# EasyEDA Pro project Source.epro

# Schematic Schematic1
Board Name: Board1; Create Date: 2026-05-11; Page Name: P1; Project Name: my devboard; Schematic Name: Schematic1; Update Date: 2026-05-15; Company: EasyEDA.com; Page Size: A4; Version: V1.0
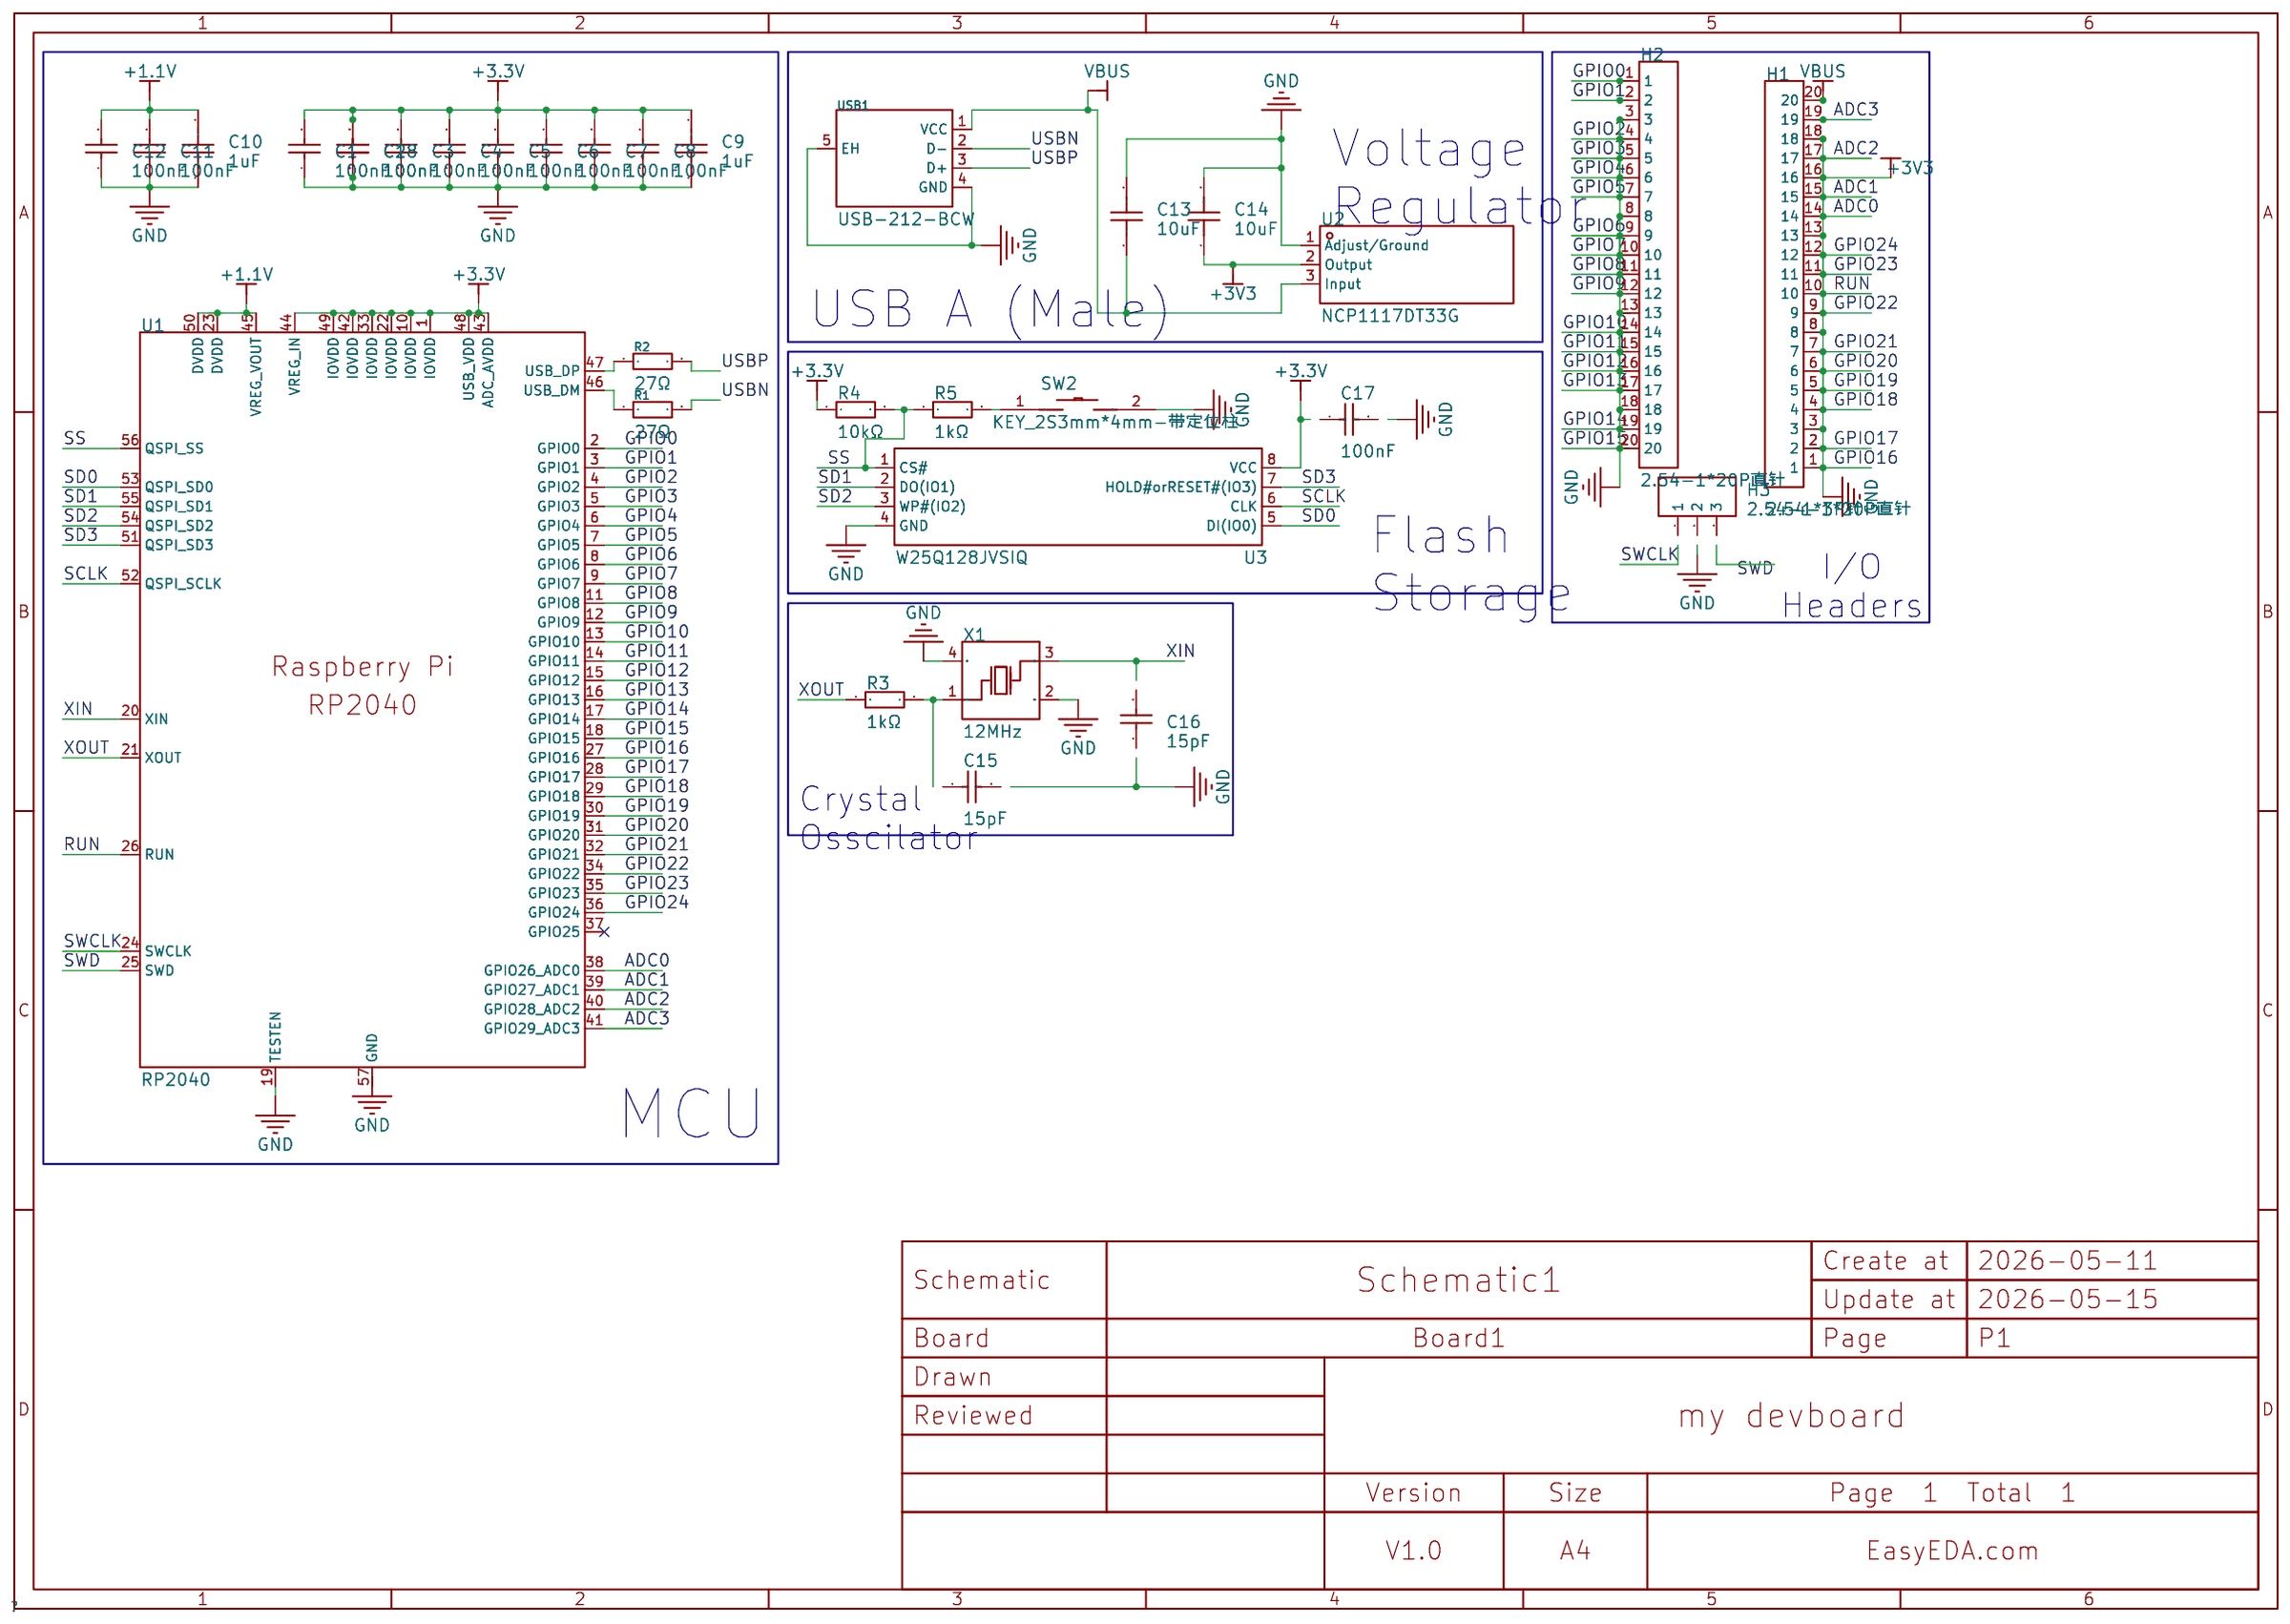
[diagram p0: schematic sheet]

## Parts
C1  100nF  [C0603]
C2  100nF  [C0603]
C3  100nF  [C0603]
C4  100nF  [C0603]
C5  100nF  [C0603]
C6  100nF  [C0603]
C7  100nF  [C0603]
C8  100nF  [C0603]
C9  1uF  [C0603]
C10  1uF  [C0603]
C11  100nF  [C0603]
C12  100nF  [C0603]
C13  10uF  [C0603]
C14  10uF  [C0603]
C15  15pF  [C0603]
C16  15pF  [C0603]
C17  100nF  [C0603]
C18  100nF  [C0603]
H1  2.54-1*20P直针  [HDR-TH_20P-P2.54-V-M-1]
H2  2.54-1*20P直针  [HDR-TH_20P-P2.54-V-M-1]
H3  2.54-1*3P针  [HDR-TH_3P-P2.54-V-M-1]
R1  27Ω  [R0603]
R2  27Ω  [R0603]
R3  1kΩ  [R0603]
R4  10kΩ  [R0603]
R5  1kΩ  [R0603]
SW2  KEY_2S3mm*4mm-带定位柱  [KEY-SMD_L4.0-W3.7-LS4.8]
U1  RP2040  [QFN-56_L7.0-W7.0-P0.40-TL-EP4.0]
U2  NCP1117DT33G  [TO-252_L6.5-W6.1-P4.58-LS9.9-BR]
U3  W25Q128JVSIQ  [SOIC-8_L5.3-W5.3-P1.27-LS8.0-BL]
USB1  USB-212-BCW  [USB-A-SMD_USB-212-BCW]
X1  12MHz  [CRYSTAL-SMD_4P-L3.2-W2.5-BL]

## Library data of the parts
C1-C8 C11 C12 C17 C18 = CT41G-0603-2X1-50V-0.1uF-K(N): Capacitance:100nF Tolerance:±10% Tolerance:±10% Voltage Rating:50V Temperature Coefficient:-; LCSC Part Name: 100nF ±10% 50V; Supplier Part: C125205; Manufacturer: TORCH(火炬); Supplier Footprint: 0603; JLCPCB Part Class: Extended Part; Datasheet: https://item.szlcsc.com/datasheet/CT41G-0603-2X1-50V-0.1uF-K(N)/136481.html; Supplier: LCSC; Tolerance: ±10%; Voltage Rating: 50V
C9 C10 = CL10A105KB8NNNC: Capacitance:1uF Tolerance:±10% Tolerance:±10% Voltage Rating:50V Temperature Coefficient:X5R; LCSC Part Name: 1uF ±10% 50V; Supplier Part: C15849; Manufacturer: SAMSUNG(三星); Supplier Footprint: 0603; JLCPCB Part Class: Basic Part; Datasheet: https://item.szlcsc.com/datasheet/CL10A105KB8NNNC/16531.html; Supplier: LCSC; Tolerance: ±10%; Voltage Rating: 50V; Temperature Coefficient: X5R
C13 C14 = CL10A106MA8NRNC: Capacitance:10uF Tolerance:±20% Tolerance:±20% Voltage Rating:25V Temperature Coefficient:X5R; LCSC Part Name: 10uF ±20% 25V; Supplier Part: C96446; Manufacturer: SAMSUNG(三星); Supplier Footprint: 0603; JLCPCB Part Class: Basic Part; Datasheet: https://item.szlcsc.com/datasheet/CL10A106MA8NRNC/97651.html; Supplier: LCSC; Tolerance: ±20%; Voltage Rating: 25V; Temperature Coefficient: X5R
C15 C16 = CL10C150JB8NNNC: Capacitance:15pF Tolerance:±5% Tolerance:±5% Voltage Rating:50V Temperature Coefficient:C0G; LCSC Part Name: 15pF ±5% 50V; Supplier Part: C1644; Manufacturer: SAMSUNG(三星); Supplier Footprint: 0603; JLCPCB Part Class: Basic Part; Datasheet: https://item.szlcsc.com/datasheet/CL10C150JB8NNNC/1996.html; Supplier: LCSC; Tolerance: ±5%; Voltage Rating: 50V; Temperature Coefficient: C0G
H1 H2 = 2.54-1*20P直针: Pin Structure:1x20P Pitch:2.54mm Row Spacing:- Circluar Pins/Square Pins:Pin Header Mounting Type:Through Hole Number of Rows:1 Number of Pins:20P Current Rating:3A Voltage Rating (Max):- Length of Mating Pin:- Insulation Height:- Length of End Connection; LCSC Part Name: 1x20P 间距:2.54mm 方针 直插; Supplier Part: C50981; Manufacturer: BOOMELE(博穆精密); Supplier Footprint: 插件,P=2.54mm; JLCPCB Part Class: Extended Part; Datasheet: https://item.szlcsc.com/datasheet/2.54-1*20P%25E7%259B%25B4%25E9%2592%2588/51993.html; Supplier: LCSC; Pin Structure: 1x20P; Pitch: 2.54mm; Circluar Pins/Square Pins: Pin Header; Mounting Type: Through Hole; Number of Rows: 1; Number of Pins: 20P; Current Rating: 3A; Contact Material: Brass; Operating Temperature: -40℃~+105℃; Color: Black
H3 = 2.54-1*3P针: Pin Structure:1x3P Pitch:2.54mm Row Spacing:- Circluar Pins/Square Pins:Pin Header Mounting Type:Through Hole Number of Rows:1 Number of Pins:3P Current Rating:3A Voltage Rating (Max):- Length of Mating Pin:6mm Insulation Height:2.5mm Length of End Connec; LCSC Part Name: 1x3P 间距:2.54mm 方针 直插; Supplier Part: C49257; Manufacturer: BOOMELE(博穆精密); Supplier Footprint: 插件,P=2.54mm; JLCPCB Part Class: Extended Part; Datasheet: https://item.szlcsc.com/datasheet/2.54-1*3P%25E9%2592%2588/50265.html; Supplier: LCSC; Pin Structure: 1x3P; Pitch: 2.54mm; Circluar Pins/Square Pins: Pin Header; Mounting Type: Through Hole; Number of Rows: 1; Number of Pins: 3P; Current Rating: 3A; Length of Mating Pin: 6mm; Insulation Height: 2.5mm; Length of End Connection Pin: 3mm; Contact Material: Brass; Contact Plating: Gold; Operating Temperature: -40℃~+105℃; Color: Black
R1 R2 = CR0603JA0270G: Type:Thick Film Resistor Resistance:27Ω Tolerance:±5% Tolerance:±5% Power(Watts):100mW Voltage-Supply(Max):50V Temperature Coefficient:±200ppm/℃ Temperature Coefficient:±200ppm/℃ Operating Temperature:-55℃~+125℃ Operating Temperature:-55℃~+125℃; LCSC Part Name: 厚膜电阻 27Ω ±5% 100mW; Supplier Part: C101313; Manufacturer: LIZ(丽智电子); Supplier Footprint: 0603; JLCPCB Part Class: Extended Part; Datasheet: https://item.szlcsc.com/datasheet/CR0603JA0270G/102528.html; Supplier: LCSC; Type: Thick Film Resistor; Tolerance: ±5%; Power(Watts): 100mW; Voltage-Supply(Max): 50V; Temperature Coefficient: ±200ppm/℃; Operating Temperature: -55℃~+125℃
R3 R5 = RC0603FR-071KL: Type:Thick Film Resistor Resistance:1kΩ Tolerance:±1% Tolerance:±1% Power(Watts):100mW Voltage-Supply(Max):75V Temperature Coefficient:±100ppm/℃ Temperature Coefficient:±100ppm/℃ Operating Temperature:-55℃~+155℃ Operating Temperature:-55℃~+155℃; LCSC Part Name: 厚膜电阻 1kΩ ±1% 100mW; Supplier Part: C22548; Manufacturer: YAGEO(国巨); Supplier Footprint: 0603; JLCPCB Part Class: Extended Part; Datasheet: https://item.szlcsc.com/datasheet/RC0603FR-071KL/23274.html; Supplier: LCSC; Type: Thick Film Resistor; Tolerance: ±1%; Power(Watts): 100mW; Voltage-Supply(Max): 75V; Temperature Coefficient: ±100ppm/℃; Operating Temperature: -55℃~+155℃
R4 = RC0603FR-0710KL: Type:Thick Film Resistor Resistance:10kΩ Tolerance:±1% Tolerance:±1% Power(Watts):100mW Voltage-Supply(Max):75V Temperature Coefficient:±100ppm/℃ Temperature Coefficient:±100ppm/℃ Operating Temperature:-55℃~+155℃ Operating Temperature:-55℃~+155℃; LCSC Part Name: 厚膜电阻 10kΩ ±1% 100mW; Supplier Part: C98220; Manufacturer: YAGEO(国巨); Supplier Footprint: 0603; JLCPCB Part Class: Extended Part; Datasheet: https://item.szlcsc.com/datasheet/RC0603FR-0710KL/99429.html; Supplier: LCSC; Type: Thick Film Resistor; Tolerance: ±1%; Power(Watts): 100mW; Voltage-Supply(Max): 75V; Temperature Coefficient: ±100ppm/℃; Operating Temperature: -55℃~+155℃
SW2 = KEY_2S3mm*4mm-带定位柱: Supplier Part: C9900019844; Supplier Footprint: 二脚小乌龟SW_PUSH-带定位柱; JLCPCB Part Class: Extended Part; Supplier: LCSC
U1 = RP2040: Supplier Part: C2961140; Manufacturer: Raspberry Pi(树莓派); Supplier Footprint: QFN-56-EP(7x7); JLCPCB Part Class: Extended Part; Datasheet: https://atta.szlcsc.com/upload/public/pdf/source/20220208/8D54DD1C91A7987165C42A5C4D6BB336.pdf; Supplier: LCSC
U2 = NCP1117DT33G: Output Type:Fixed Voltage - Supply:20V Output Voltage:3.3V Output Voltage:3.3V Output Current:1A Power Supply Rejection Ratio (PSRR):64dB@(120Hz) Voltage Dropout:1.2V@(800mA) standby current:6mA Noise:0.003%Vout Features:Over Current Protection Operating; LCSC Part Name: 停产 1.0 A 低压差正电压固定及可调稳压器 停产; Supplier Part: C154606; Manufacturer: onsemi(安森美); Supplier Footprint: TO-252; JLCPCB Part Class: Extended Part; Datasheet: https://item.szlcsc.com/datasheet/NCP1117DT33G/165948.html; Supplier: LCSC; Output Type: Fixed; Voltage - Supply: 20V; Output Voltage: 3.3V; Output Current: 1A; Power Supply Rejection Ratio (PSRR): 64dB@(120Hz); Voltage Dropout: 1.2V@(800mA); standby current: 6mA; Noise: 0.003%Vout; Features: Over Current Protection; Operating Temperature: 0℃~+125℃; Output Configuration: Positive; Number of Outputs: 1
U3 = W25Q128JVSIQ_C113767: Interface:SPI Memory Size:- Clock Frequency:133MHz Voltage - Supply:2.7V~3.6V Voltage - Supply:2.7V~3.6V Program / Erase Cycles:100,000 Cycles Page Programming Time (Tpp):3ms Operating Temperature:- Operating Temperature:-; LCSC Part Name: 支持双路/四路SPI接口的3V、128Mbit 串行闪存; Supplier Part: C113767; Manufacturer: Winbond(华邦); Supplier Footprint: SOIC-8-208mil; JLCPCB Part Class: Extended Part; Datasheet: https://item.szlcsc.com/datasheet/W25Q128JVSIQ/115003.html; Supplier: LCSC; Interface: SPI; Clock Frequency: 133MHz; Voltage - Supply: 2.7V~3.6V; Program / Erase Cycles: 100,000 Cycles; Page Programming Time (Tpp): 3ms
USB1 = USB-212-BCW: Connector Type:Type-A Protocol Standard:USB 2.0 Gender:Male Mounting Type:Surface Mount, Right Angle Number of Contacts:4P Number of Ports:1 Current Rating-Power:1.5A Voltage Rating:30V Connect-Disconnect Life:5,000 Cycles Length:18.8mm Detection color:Bl; LCSC Part Name: Type-A 公 卧贴; Supplier Part: C720521; Manufacturer: XUNPU(讯普); Supplier Footprint: SMD; JLCPCB Part Class: Extended Part; Datasheet: https://item.szlcsc.com/datasheet/USB-212-BCW/763528.html; Supplier: LCSC; Connector Type: Type-A; Protocol Standard: USB 2.0; Gender: Male; Mounting Type: Surface Mount, Right Angle; Number of Contacts: 4P; Number of Ports: 1; Current Rating-Power: 1.5A; Voltage Rating: 30V; Connect-Disconnect Life: 5,000 Cycles; Length: 18.8mm; Detection color: Black; Operating Temperature: -20℃~+70℃
X1 = X322512MSB4SI: Type:Crystal Oscillator Frequency:12MHz Normal temperature Frequency Tolerance:±10ppm Normal temperature Frequency Tolerance:±10ppm Load Capacitance:20pF Frequency Stability:±20ppm Frequency Stability:±20ppm Operating Temperature:-40℃~+85℃ Operating Tempe; LCSC Part Name: YSX321SL 12MHZ 4P 3225 20PF ±10PPM -40~85℃ (±20PPM); Supplier Part: C9002; Manufacturer: YXC(扬兴晶振); Supplier Footprint: SMD3225-4P; JLCPCB Part Class: Basic Part; Datasheet: https://item.szlcsc.com/datasheet/X322512MSB4SI/9522.html; Supplier: LCSC; Type: Crystal Oscillator; Normal temperature Frequency Tolerance: ±10ppm; Load Capacitance: 20pF; Frequency Stability: ±20ppm; Operating Temperature: -40℃~+85℃

## Nets
+1.1V: C10.2 C11.2 C12.2 U1.23(DVDD) U1.45(VREG_VOUT) U1.50(DVDD)
+3.3V: C1.2 C2.2 C3.2 C4.2 C5.2 C6.2 C7.2 C8.2 C9.2 C18.2 R4.1 U1.1(IOVDD) U1.10(IOVDD) U1.22(IOVDD) U1.33(IOVDD) U1.42(IOVDD) U1.43(ADC_AVDD) U1.44(VREG_IN) U1.48(USB_VDD) U1.49(IOVDD) U3.8(VCC)
+3V3: C1.1 C2.1 C3.1 C4.1 C5.1 C6.1 C7.1 C8.1 C9.1 C10.1 C11.1 C12.1 C13.2 C14.1 C14.2 C18.1 H1.1 H1.2 H1.3 H1.4 H1.5 H1.6 H1.7 H1.8 H1.9 H1.10 H1.11 H1.12 H1.13 H1.14 H1.15 H1.16 H1.17 H1.18 H2.3 H2.4 H2.5 H2.6 H2.7 H2.8 H2.9 H2.10 H2.11 H2.12 H2.13 H2.14 H2.15 H2.16 H2.17 H2.18 H2.19 H2.20 SW2.2 U1.4(GPIO2) U1.5(GPIO3) U1.6(GPIO4) U1.7(GPIO5) U1.8(GPIO6) U1.9(GPIO7) U1.11(GPIO8) U1.12(GPIO9) U1.13(GPIO10) U1.14(GPIO11) U1.15(GPIO12) U1.16(GPIO13) U1.17(GPIO14) U1.18(GPIO15) U1.19(TESTEN) U1.26(RUN) U1.27(GPIO16) U1.28(GPIO17) U1.29(GPIO18) U1.30(GPIO19) U1.31(GPIO20) U1.32(GPIO21) U1.34(GPIO22) U1.35(GPIO23) U1.36(GPIO24) U1.38(GPIO26_ADC0) U1.39(GPIO27_ADC1) U1.40(GPIO28_ADC2) U1.57(GND) U2.1(Adjust/Ground) U2.2(Output) U3.4(GND) USB1.4(GND) USB1.5(EH) X1.2(GND) X1.4(GND)
VBUS: C13.1 H1.20 U2.3(Input) USB1.1(VCC)
ADC3: H1.19 U1.41(GPIO29_ADC3)
GPIO0: H2.1 U1.2(GPIO0)
GPIO1: H2.2 U1.3(GPIO1)
SCLK: U1.52(QSPI_SCLK) U3.6(CLK)
SD0: U1.53(QSPI_SD0) U3.5(DI(IO0))
SD1: U1.55(QSPI_SD1) U3.2(DO(IO1))
SD2: U1.54(QSPI_SD2) U3.3(WP#(IO2))
SD3: U1.51(QSPI_SD3) U3.7(HOLD#orRESET#(IO3))
SS: R4.2 R5.1 U1.56(QSPI_SS) U3.1(CS#)
SWCLK: U1.24(SWCLK)
SWD: U1.25(SWD)
USBN: R1.2 USB1.2(D-)
USBP: R2.2 USB1.3(D+)
XIN: U1.20(XIN) X1.3(OSC2)
XOUT: R3.1 U1.21(XOUT)
$1N3935: R1.1 U1.46(USB_DM)
$1N3938: R2.1 U1.47(USB_DP)
$1N4390: R5.2 SW2.1
Net-(R3-2): R3.2 X1.1(OSC1)

Not connected (* = marked no-connect by the designer): C15 1 2; C16 1 2; C17 1 2; H3 1 2 3; U1 37(GPIO25)*

## Notes on the sheet
- Voltage
  Regulator
- USB A (Male)
- Flash
  Storage
- I/O
  Headers
- Crystal
  Osscilator
- MCU

# Board PCB1
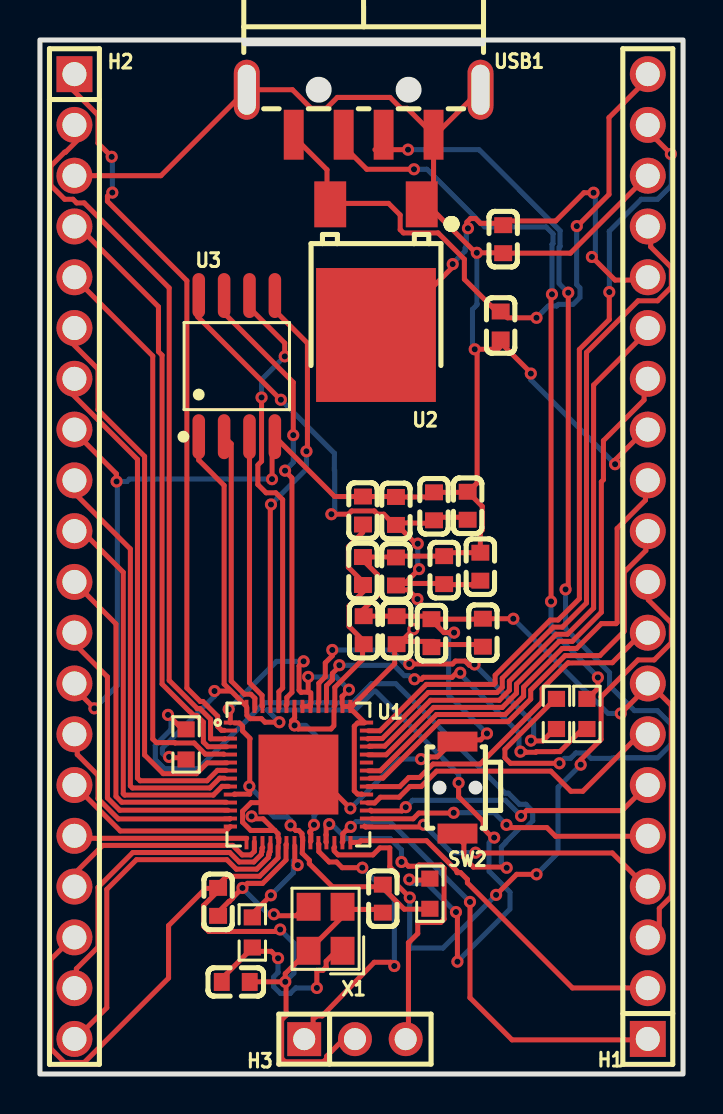
[diagram p1: board, top side]
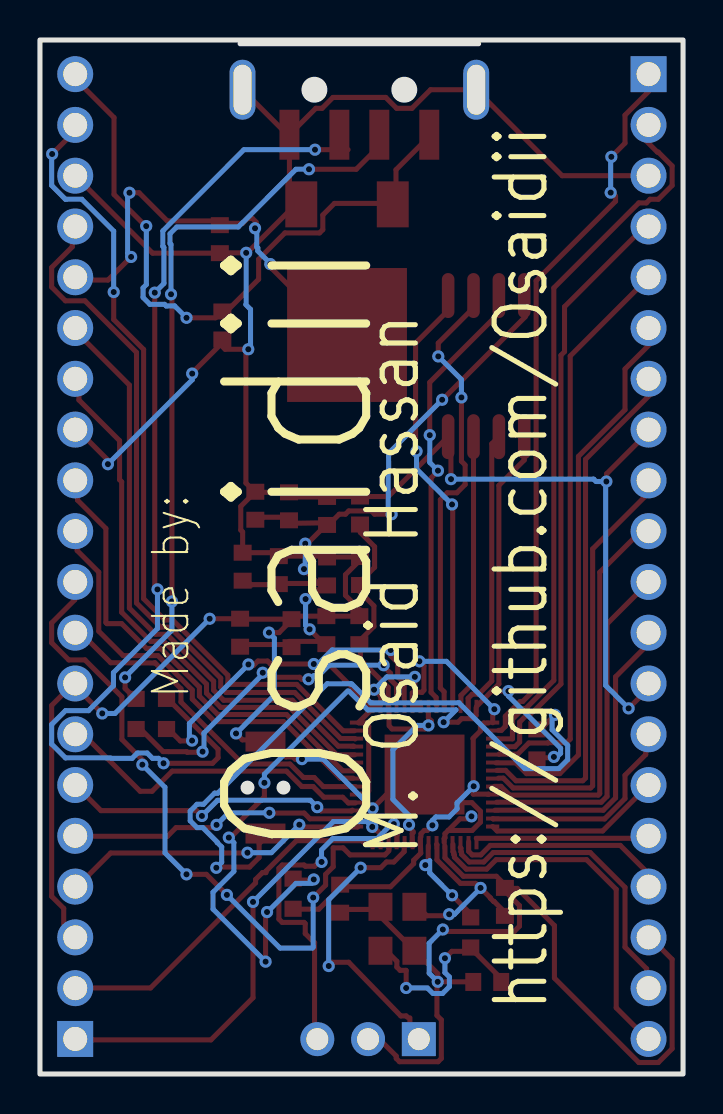
[diagram p2: board, bottom side, seen from below]

Outline 32.19 x 51.72 mm; copper layers: Top Layer, Bottom Layer. Coordinates in mm from the lower left corner of the outline.
Outline path: rectangle 0,51.72 32.19,0
Stack: Top Layer 0.035mm / Dielectric1 1.51mm FR4 er 4.5 / Bottom Layer 0.035mm

## Design rules (mm)
spacing copperThickness1oz (default): track to track 0.102, other pairs 0.152 to 0.3
spacing copperThickness2oz: track to track 0.203, other pairs 0.152 to 0.3
spacing Plane_innerPlane: track to track 0.102, other pairs 0.152 to 0.3
spacing Copper_copperRegion: track to track 0.102, other pairs 0.152 to 0.3
track width copperThickness1oz (default): min 0.127, default 0.254, max 2.54
track width copperThickness2oz: min 0.203, default 0.254, max 2.54
differential pair differentialPair (default): width min 0.127, default 0.254, max 2.54; gap min 0.152, default 0.152

## Placement (name value [footprint] x y rotation side)
C1  100nF  [C0603]  21.41 28.43 90 top
C2  100nF  [C0603]  19.6 22.05 90 top
C3  100nF  [C0603]  20.23 25.21 90 top
C4  100nF  [C0603]  22.17 22.08 90 top
C5  100nF  [C0603]  17.86 22.2 90 top
C6  100nF  [C0603]  17.82 25.14 90 top
C7  100nF  [C0603]  17.82 28.17 90 top
C8  100nF  [C0603]  19.73 28.4 90 top
C9  1uF  [C0603]  22.05 25.38 90 top
C10  1uF  [C0603]  16.17 28.19 90 top
C11  100nF  [C0603]  16.17 25.16 90 top
C12  100nF  [C0603]  16.2 22.2 90 top
C13  10uF  [C0603]  23.06 37.44 90 top
C14  10uF  [C0603]  23.19 41.76 90 top
C15  15pF  [C0603]  9.8 4.61 180 top
C16  15pF  [C0603]  8.92 8.61 90 top
C17  100nF  [C0603]  17.16 8.77 90 top
H1  2.54-1*20P直针  [HDR-TH_20P-P2.54-V-M-1]  30.43 25.89 90 top
H2  2.54-1*20P直针  [HDR-TH_20P-P2.54-V-M-1]  1.73 25.89 270 top
H3  2.54-1*3P针  [HDR-TH_3P-P2.54-V-M]  15.77 1.74 0 top
R1  27Ω  [R0603]  27.38 18.01 90 top
R2  27Ω  [R0603]  25.86 18.01 90 top
R3  1kΩ  [R0603]  10.63 7.08 270 top
R4  10kΩ  [R0603]  19.52 9.02 90 top
R5  1kΩ  [R0603]  7.31 16.49 90 top
SW2  KEY_2S3mm*4mm-带定位柱  [KEY-SMD_L4.0-W3.7-LS4.8]  20.9 14.33 90 top
U1  RP2040  [QFN-56_L7.0-W7.0-P0.40-TL-EP4.0]  12.94 14.98 0 top
U2  NCP1117DT33G  [TO-252_L6.5-W6.1-P4.58-LS9.9-BR]  16.82 40.23 90 top
U3  W25Q128JVSIQ  [SOIC-8_L5.3-W5.3-P1.27-LS8.0-BL]  9.85 35.41 0 top
USB1  USB-212-BCW  [USB-A-SMD_USB-212-BCW]  16.2 48.11 180 top
X1  12MHz  [CRYSTAL-SMD_4P-L3.2-W2.5-BL]  14.3 7.27 90 top

## Footprints (pads in the part's own frame, mm; a bottom-side part is the same pattern mirrored in y, then rotated)
C0603
  rect 0.8x0.9 smd: 1(-0.7,0) 2(0.7,0)
CRYSTAL-SMD_4P-L3.2-W2.5-BL
  rect 1.4x1.2 smd: 1(-1.1,-0.85) 2(1.1,-0.85) 3(1.1,0.85) 4(-1.1,0.85)
HDR-TH_3P-P2.54-V-M
  rect 1.7x1.7 hole 1.1: 1(-2.54,0)
  round 1.7 hole 1.1: 2(0,0) 3(2.54,0)
HDR-TH_20P-P2.54-V-M-1
  rect 1.8x1.8 hole 1.2: 1(-24.13,0)
  round 1.8 hole 1.2: 2(-21.59,0) 3(-19.05,0) 4(-16.51,0) 5(-13.97,0) 6(-11.43,0) 7(-8.89,0) 8(-6.35,0) 9(-3.81,0) 10(-1.27,0) 11(1.27,0) 12(3.81,0) 13(6.35,0) 14(8.89,0) 15(11.43,0) 16(13.97,0) 17(16.51,0) 18(19.05,0) 19(21.59,0) 20(24.13,0)
KEY-SMD_L4.0-W3.7-LS4.8
  rect 1x2 smd: 1(-2.3,0) 2(2.3,0)
QFN-56_L7.0-W7.0-P0.40-TL-EP4.0
  rect 0.665x0.2 smd: 1(-3.408,2.6) 2(-3.408,2.2) 3(-3.408,1.8) 4(-3.408,1.4) 5(-3.408,1) 6(-3.408,0.6) 7(-3.408,0.2) 8(-3.408,-0.2) 9(-3.408,-0.6) 10(-3.408,-1) 11(-3.408,-1.4) 12(-3.408,-1.8) 13(-3.408,-2.2) 14(-3.408,-2.6) 29(3.408,-2.6) 30(3.408,-2.2) 31(3.408,-1.8) 32(3.408,-1.4) 33(3.408,-1) 34(3.408,-0.6) 35(3.408,-0.2) 36(3.408,0.2) 37(3.408,0.6) 38(3.408,1) 39(3.408,1.4) 40(3.408,1.8) 41(3.408,2.2) 42(3.408,2.6)
  rect 0.2x0.665 smd: 15(-2.6,-3.408) 16(-2.2,-3.408) 17(-1.8,-3.408) 18(-1.4,-3.408) 19(-1,-3.408) 20(-0.6,-3.408) 21(-0.2,-3.408) 22(0.2,-3.408) 23(0.6,-3.408) 24(1,-3.408) 25(1.4,-3.408) 26(1.8,-3.408) 27(2.2,-3.408) 28(2.6,-3.408) 43(2.6,3.408) 44(2.2,3.408) 45(1.8,3.408) 46(1.4,3.408) 47(1,3.408) 48(0.6,3.408) 49(0.2,3.408) 50(-0.2,3.408) 51(-0.6,3.408) 52(-1,3.408) 53(-1.4,3.408) 54(-1.8,3.408) 55(-2.2,3.408) 56(-2.6,3.408)
  rect 4x4 smd: 57(0,0)
R0603
  rect 0.806x0.864 smd: 1(-0.753,0) 2(0.753,0)
SOIC-8_L5.3-W5.3-P1.27-LS8.0-BL
  oval 0.63x2.25 smd: 1(-1.905,-3.53) 2(-0.635,-3.53) 3(0.635,-3.53) 4(1.905,-3.53) 5(1.905,3.53) 6(0.635,3.53) 7(-0.635,3.53) 8(-1.905,3.53)
TO-252_L6.5-W6.1-P4.58-LS9.9-BR
  rect 2.3x1.6 smd: 1(3.268,-2.29) 3(3.267,2.29)
  rect 6.7x6 smd: 2(-3.268,0)
USB-A-SMD_USB-212-BCW
  rect 1x2.5 smd: 1(3.5,1.125) 2(1,1.125) 3(-1,1.125) 4(-3.5,1.125)
  oval 1.3x3 hole 0.9x2.5: 5(-5.85,-1.125) 5(5.85,-1.125)

## Nets
+1.1V: C10.1 C11.1 C12.1 U1.23 U1.45 U1.50
+3.3V: C1.1 C2.1 C3.1 C4.1 C5.1 C6.1 C7.1 C8.1 C9.1 C17.2 R4.1 U1.1 U1.10 U1.22 U1.33 U1.42 U1.43 U1.44 U1.48 U1.49 U3.8
+3V3: C14.2 H1.16 U2.2
GND: C1.2 C2.2 C3.2 C4.2 C5.2 C6.2 C7.2 C8.2 C9.2 C10.2 C11.2 C12.2 C13.1 C14.1 C15.1 C16.2 C17.1 H1.3 H1.8 H1.13 H1.18 H2.3 H2.8 H2.13 H2.18 H3.2 SW2.2 U1.19 U1.57 U2.1 U3.4 USB1.4 USB1.5 X1.2 X1.4
VBUS: C13.2 H1.20 U2.3 USB1.1
ADC0: H1.14 U1.38
ADC1: H1.15 U1.39
ADC2: H1.17 U1.40
ADC3: H1.19 U1.41
GPIO0: H2.1 U1.2
GPIO1: H2.2 U1.3
GPIO2: H2.4 U1.4
GPIO3: H2.5 U1.5
GPIO4: H2.6 U1.6
GPIO5: H2.7 U1.7
GPIO6: H2.9 U1.8
GPIO7: H2.10 U1.9
GPIO8: H2.11 U1.11
GPIO9: H2.12 U1.12
GPIO10: H2.14 U1.13
GPIO11: H2.15 U1.14
GPIO12: H2.16 U1.15
GPIO13: H2.17 U1.16
GPIO14: H2.19 U1.17
GPIO15: H2.20 U1.18
GPIO16: H1.1 U1.27
GPIO17: H1.2 U1.28
GPIO18: H1.4 U1.29
GPIO19: H1.5 U1.30
GPIO20: H1.6 U1.31
GPIO21: H1.7 U1.32
GPIO22: H1.9 U1.34
GPIO23: H1.11 U1.35
GPIO24: H1.12 U1.36
RUN: H1.10 U1.26
SCLK: U1.52 U3.6
SD0: U1.53 U3.5
SD1: U1.55 U3.2
SD2: U1.54 U3.3
SD3: U1.51 U3.7
SS: R4.2 R5.1 U1.56 U3.1
SWCLK: H3.1 U1.24
SWD: H3.3 U1.25
USBN: R1.2 USB1.2
USBP: R2.2 USB1.3
XIN: C16.1 U1.20 X1.3
XOUT: R3.1 U1.21
$1N3718: C15.2 R3.2 X1.1
$1N3935: R1.1 U1.46
$1N3938: R2.1 U1.47
$1N4390: R5.2 SW2.1

Pads without a net: U1 37

## Via types
v1: diameter 0.61, hole 0.305, Top Layer to Bottom Layer, 94 vias

## Routing (per net, layer and track width the routed paths; a pad name or vN(x,y) marks a point on that pad's centre or on a via; arc(x,y) is an arc through that point)
+1.1V: length 21.7
  Top Layer w0.254: 16.21,21.55 16.21,21.65 15.48,22.39 15.48,23.42 16.21,24.15 16.21,24.37 16.16,24.43 16.16,24.63 15.44,25.34 15.44,26.38 16.16,27.09 16.16,27.44 16.1,27.49 ; 14.72,18.39 14.76,18.43 14.76,19.34 16.15,20.73 16.15,21.26 ; 14.57,17.26 12.92,17.26 v1(12.75,17.44) 12.75,17.5 12.59,17.66 12.75,17.81 12.75,18.24 ; v1(13.72,12.47) 13.72,12.33 13.52,12.13 13.52,12.07 13.56,12.02 13.56,11.65 13.54,11.63 ; 14.72,18.17 14.72,17.42 ; 14.66,17.37 14.57,17.26
  Bottom Layer w0.254: v1(12.75,17.44) 13.31,17.44 14.52,16.22 14.52,13.74 13.72,12.93 v1(13.72,12.47)
+3.3V: length 74.6
  Top Layer w0.254: 13.07,19.1 13.07,19.09 ; 13.07,19.1 12.97,19.2 12.97,20.42 v1(13.2,20.64) ; 13.07,19.1 13.44,19.1 13.43,19.11 v1(13.43,19.87) ; v1(18.98,25.26) 18.26,24.54 20.01,24.54 ; 13.56,19.07 13.56,18.55 13.52,18.51 ; 20.07,24.54 20.01,24.48 ; 16.12,13.99 16.11,14 15.9,14 15.74,14.16 15.74,17.4 15.9,17.56 16.21,17.56 ; 15.13,18.52 15.13,18.89 15.13,18.89 v1(15.47,19.22) ; 15.6,18.37 17.76,20.53 17.76,21.46 ; 19.71,27.86 19.4,27.55 17.91,27.57 ; 21.86,24.71 21.61,24.46 ; v1(18.9,23.76) 18.44,24.22 17.86,24.22 ; 13.16,11.83 13.16,11.68 13.13,11.05 13.49,10.69 13.49,10.52 14.65,9.36 ; 9.74,13.98 9.74,14 10.5,14 10.5,16.78 ; v1(9.45,18.25) 9.53,18.17 9.53,17.57 ; 21.61,24.48 20.07,24.48 ; 14.66,9.37 16.77,9.37 ; 19.72,27.85 21,27.85 21.14,27.72 ; 17.8,27.41 17.21,28 16.9,28 16.74,28.17 15.6,28.17 15.44,28 v1(14.59,28) ; 17,9.47 18.24,8.24 19.31,8.24 ; 15.52,18.45 15.46,18.39 15.18,18.39 ; 18.16,21.64 19.74,21.64 ; 18.16,21.64 18.16,21.71 v1(18.69,22.24) ; 18.16,21.64 18.14,21.62 ; 13.13,18.39 13.52,18.39 13.54,18.37 ; 18.14,21.64 17.8,21.64 ; 16.26,17.57 15.54,18.28 ; 21.92,21.53 21.87,21.48 19.74,21.48 ; 17.93,27.41 18.81,26.53 v1(18.91,26.53) ; 7.9,38.49 7.9,37.87 12.05,33.73 v1(12.06,33.73) ; v1(12.55,12.44) 12.8,12.18 12.96,12.18 13.12,12.02 13.12,11.87 ; 10.52,16.78 10.14,17.16 10.14,17.4 9.98,17.56 9.75,17.56
  Bottom Layer w0.254: 14.73,30.2 14.74,31.05 v1(12.06,33.73) ; v1(18.69,22.24) 18.9,22.45 v1(18.9,23.76) ; v1(12.55,12.44) 12.56,12.45 12.56,12.68 12.38,12.86 11.72,12.86 11.32,13.26 11.32,13.56 v1(10.48,14.39) ; 14.76,30.2 14.76,28.17 v1(14.59,28) ; v1(13.2,20.64) 11.84,20.64 v1(9.45,18.25) ; v1(18.91,26.53) 18.91,25.32 v1(18.98,25.26) ; v1(13.43,19.87) 14.83,19.87 v1(15.47,19.22)
+3V3: length 21
  Top Layer w0.254: v1(27.63,40.87) 28.79,39.72 30.52,39.72 ; 17.19,36.89 20.66,40.37 v1(20.66,40.51) ; v1(21.43,42.3) 21.37,42.36 21.37,42.61 21.55,42.79 21.81,42.79 22.04,42.55 23.05,42.55 ; v1(27.71,44.08) 27.23,44.08 25.82,42.67 23.3,42.67
  Bottom Layer w0.254: v1(27.63,40.87) 27.81,41.05 27.81,43.99 v1(27.71,44.08) ; v1(20.66,40.51) 20.66,40.54 21.29,41.17 21.29,41.32 21.34,41.38 21.34,42.22 v1(21.43,42.3)
GND: length 220.3
  Top Layer w0.254: 11.96,11.59 11.96,11.77 11.92,11.82 11.92,12.02 11.76,12.18 ; H1.18 26.55,41.06 23.32,41.06 ; v1(28.79,30.5) 28.79,30.71 30.29,32.21 ; 10.57,4.65 10.45,4.53 ; 10.57,4.65 10.66,4.56 10.71,4.61 v1(12.28,4.61) 12.28,5.02 13.41,6.15 ; 10.57,4.65 10.54,4.68 ; 11.62,31.5 11.62,29.76 v1(11.62,29.76) ; v1(29.08,18.04) 30.27,19.23 30.27,19.43 ; 30.56,19.48 31.61,18.44 31.61,8.89 31,8.28 31,6.76 ; 1.61,6.79 0.55,5.74 0.55,1.27 1.24,0.58 2.22,0.58 6.44,4.8 6.44,7.43 8.3,9.28 8.93,9.28 ; USB1.4 19.8,46.98 USB1.5 ; USB1.4 19.7,44.09 U2.1 ; USB1.4 18.38,48.31 18.07,48.31 17.53,48.85 14.88,48.85 14.34,48.31 13.57,48.31 12.64,49.23 USB1.5 6.05,44.94 H2.3 ; v1(21.76,36.25) 22.93,36.25 23.16,36.49 ; 23.16,36.49 22.93,36.72 22.93,36.79 ; 23.16,36.49 24.57,35.07 v1(24.57,35.04) ; 11.94,13.98 11.53,13.57 10.57,13.57 10.14,13.15 10.14,12.6 10.56,12.18 11.76,12.18 ; 11.92,11.4 11.92,10.81 11,9.89 9.34,9.89 8.85,9.39 ; 12.32,4.49 12.32,2.93 12.1,2.71 12.1,0.78 12.26,0.62 14.19,0.62 14.36,0.78 14.36,0.9 15.14,1.68 15.78,1.68 ; 20.54,16.51 19.89,15.86 19.53,15.86 19.42,15.75 v1(19.08,15.75) ; 15.16,8.23 15.04,8.35 ; U3.4 14.75,28.89 C10.2 17.8,28.89 C7.2 19.49,28.87 C8.2 21.38,29.1 ; v1(23.7,22.77) 22.19,22.77 ; 19.22,43.58 19.3,43.58 21.84,41.05 ; v1(20.73,22.08) 20.22,22.08 19.64,22.66 ; 23.18,41.08 v1(21.87,41.08) ; 13.92,13.96 14.87,13.96 v1(15.54,13.29) ; 8.97,9.35 8.97,9.21 8.19,8.43 8.19,7.39 8.45,7.13 11.91,7.13 ; 17.06,8.23 15.31,8.23 ; v1(3.84,29.64) 3.83,29.65 3.83,30.03 1.43,32.42 ; C1.2 22.14,28.4 22.14,27.21 22.05,27.12 C9.2 20.41,26.08 C3.2 17.89,25.91 C6.2 17.8,25.86 C11.2 16.17,25.71 16.9,24.98 16.9,23.95 16.17,23.22 16.17,22.94 16.2,22.9 19.45,22.9 C2.2 22.01,22.75 ; 21.47,16.71 22.06,16.71 v1(22.38,17.03) ; v1(2.73,18.29) 1.7,19.32 1.7,19.61 ; 11.76,12.18 11.17,12.77 10.71,12.77 v1(10.59,12.89) ; 15.31,8.04 13.47,6.2 13.42,6.2 ; 21.5,29.18 21.88,29.56 21.88,36.2
  Bottom Layer w0.254: 3.87,29.53 3.87,19.44 v1(2.73,18.29) ; v1(19.08,15.75) 18.01,15.75 v1(15.54,13.29) ; v1(11.62,29.76) 4.47,29.76 4.36,29.64 v1(3.84,29.64) ; v1(28.79,30.5) 24.57,34.72 v1(24.57,35.04) ; 21.89,38.49 21.65,38.25 21.65,36.26 21.66,36.25 v1(21.76,36.25) ; v1(22.38,17.03) 20.46,18.95 20.46,21.81 v1(20.73,22.08) ; v1(23.7,22.77) 28.44,18.04 v1(29.08,18.04) ; v1(12.28,4.61) 12.71,5.04 12.71,6.54 v1(12.03,7.23) ; v1(21.87,41.08) 21.87,38.52
VBUS: length 33.2
  Top Layer w0.254: 14.37,43.55 14.37,45.23 12.62,46.98 ; 14.37,43.55 14.37,43.35 ; 14.37,43.55 17.45,43.55 18.03,42.97 18.03,42.24 18.2,42.07 19.93,42.07 21.25,40.76 21.25,39.75 22.72,38.28 ; 14.37,43.55 14.34,43.55 ; 30.64,49.99 28.49,47.84 28.49,44 26.87,42.38 ; v1(24.86,37.83) 23.41,37.83 23.09,38.14
  Bottom Layer w0.254: v1(24.86,37.83) 25.45,38.42 25.87,38.42 25.95,38.5 26.69,38.5 27.03,38.84 27.03,39.33 26.87,39.49 26.87,42.4
  vias: v1(26.88,42.41)
ADC0: length 27
  Top Layer w0.254: 30.24,34.29 30.24,33.72 28.21,31.68 28.21,29.73 28.1,29.62 28.1,23.1 26.65,21.64 25.99,21.64 23.86,19.5 23.86,19.05 23.14,18.34 19.7,18.34 17.33,15.97 16.44,15.97
ADC1: length 29.2
  Top Layer w0.254: 30.34,37.09 27.72,34.46 27.72,23.31 26.41,22 25.85,22 23.5,19.65 23.5,19.2 23,18.69 19.55,18.69 17.26,16.4 16.5,16.4 16.49,16.39
ADC2: length 35.3
  Top Layer w0.254: 30.57,42.09 30.57,41.38 31.61,40.34 31.61,39.37 30.92,38.68 29.94,38.68 27.36,36.1 27.36,23.56 26.15,22.35 25.7,22.35 23.14,19.8 23.14,19.35 22.88,19.08 19.44,19.08 17.14,16.78 16.44,16.78 16.42,16.76
ADC3: length 40.4
  Top Layer w0.254: v1(31.58,46.02) 30.17,47.43 30.17,47.66 ; 16.45,17.17 17.02,17.17 19.34,19.49 22.72,19.49 22.79,19.56 22.79,19.95 25.55,22.71 25.94,22.71 27,23.78 27,36.24 28.5,37.74 v1(28.5,39.12)
  Bottom Layer w0.254: v1(31.58,46.02) 31.61,46 31.61,44.45 30.92,43.76 30.1,43.76 28.5,42.16 v1(28.5,39.12)
GPIO0: length 37
  Top Layer w0.254: v1(3.59,45.88) 2.91,46.56 2.91,47.96 1.64,49.23 1.64,50.68 ; 9.23,17.19 9.09,17.19 8.9,17.39 8.9,17.89 8.16,18.63 8.03,18.63 7.36,19.31 7.36,39.68 3.38,43.66 3.38,43.91 3.56,44.09 v1(3.62,44.09)
  Bottom Layer w0.254: v1(3.62,44.09) 3.62,45.85 v1(3.59,45.88)
GPIO1: length 35
  Top Layer w0.254: 9.26,16.77 9.26,16.77 8.54,16.77 8.54,17.75 8.01,18.28 7.88,18.28 ; 7.88,18.28 6.47,19.69 6.47,39.32 2.22,43.57 1.83,43.57 1.65,43.76 1.24,43.76 0.55,44.45 0.55,45.42 1.24,46.11 1.28,46.11 1.83,46.66 ; 7.88,18.28 7.87,18.28
GPIO2: length 30.3
  Top Layer w0.254: 1.48,42.83 5.93,38.38 5.93,36.13 6.11,35.95 6.11,19.51 7.49,18.13 ; 7.53,18.12 7.72,17.92 7.86,17.92 8.18,17.6 8.18,16.61 8.42,16.37 9.35,16.37
GPIO3: length 28.4
  Top Layer w0.254: 9.2,16 9.2,16 8.28,16 7.72,16.56 6.77,16.56 6.75,16.58 5.83,16.58 5.65,16.76 5.65,35.91 1.84,39.72
GPIO4: length 27.9
  Top Layer w0.254: 2.05,37.47 1.62,37.03 1.62,36.55 2.91,35.26 2.91,33.23 5.24,30.89 5.24,15.96 6.17,15.03 7.84,15.03 8.37,15.56 9.36,15.56
GPIO5: length 26.4
  Top Layer w0.254: 1.6,35.16 1.6,34.02 4.88,30.75 4.88,14.81 5.02,14.67 8.36,14.67 8.88,15.19 9.32,15.19
GPIO6: length 21.5
  Top Layer w0.254: 1.69,29.83 1.69,29.1 4.53,26.26 4.53,14.42 4.63,14.31 8.51,14.31 9,14.8 9.23,14.8
GPIO7: length 19.5
  Top Layer w0.254: 9.44,14.39 9.12,14.39 8.68,13.95 4.24,13.95 4.17,14.03 4.17,25.1 2.07,27.2
GPIO8: length 17.2
  Top Layer w0.254: 9.33,13.6 4.09,13.6 3.81,13.89 3.81,22.52 1.74,24.58
GPIO9: length 15.3
  Top Layer w0.254: 1.65,22.08 1.65,21.59 3.38,19.87 3.38,13.81 3.99,13.2 9.41,13.2
GPIO10: length 10.7
  Top Layer w0.254: 9.52,12.78 9.5,12.76 3.93,12.76 2.91,13.78 2.91,14.94 1.87,15.98 1.87,16.99
GPIO11: length 8.8
  Top Layer w0.254: H2.15 4.02,12.16 9.31,12.16 9.53,12.38
GPIO12: length 8.6
  Top Layer w0.254: 1.97,12.22 2.4,11.79 10.35,11.79
GPIO13: length 11
  Top Layer w0.254: 10.73,11.61 10.73,11.14 10.56,10.96 10.12,10.96 9.65,11.44 3.14,11.44 1.85,10.15 1.85,9.29
GPIO14: length 15.2
  Top Layer w0.254: 1.82,4.17 1.82,5.27 2.91,6.35 2.91,9.34 4.65,11.08 9.5,11.08 9.98,10.6 10.7,10.6 11.09,10.99 11.09,11.09 11.12,11.12 11.12,11.29 11.16,11.33
GPIO15: length 17.7
  Top Layer w0.254: 1.96,1.93 3.35,3.31 3.35,9.24 4.83,10.72 9.36,10.72 9.83,10.25 10.85,10.25 11.44,10.84 11.44,10.95 11.47,10.98 11.47,11.08 11.52,11.12 11.52,11.49
GPIO16: length 22.8
  Top Layer w0.254: v1(21.53,8.61) 21.53,3.81 23.63,1.71 29.98,1.71 ; v1(15.56,12.36) 15.38,12.18 15.32,12.18 15.16,12.02 15.16,11.63 15.13,11.6
  Bottom Layer w0.254: v1(21.53,8.61) 17.51,12.63 15.82,12.63 v1(15.56,12.36)
GPIO17: length 18.1
  Top Layer w0.254: 30.44,4.31 26.66,4.31 21.4,9.56 21.4,9.73 21.06,10.07 20.89,10.07 20.88,10.08 20.88,10.14 19.36,11.67 16.06,11.67 15.98,11.58 15.57,11.58
GPIO18: length 15.2
  Top Layer w0.254: v1(21.81,11.07) 21.82,11.05 28.65,11.05 30.18,9.53 ; v1(19.21,12.47) 19.1,12.36 16.3,12.36 16.26,12.4
  Bottom Layer w0.254: v1(19.21,12.47) 20.61,11.07 v1(21.81,11.07)
GPIO19: length 14.4
  Top Layer w0.254: 30.39,11.89 25.81,11.89 25.38,12.33 23.48,12.33 23.35,12.46 v1(23.35,12.46) ; 16.61,12.77 18.68,12.77 18.97,13.05 20.7,13.05 v1(20.71,13.07)
  Bottom Layer w0.254: v1(20.71,13.07) 22.75,13.07 v1(23.35,12.46)
GPIO20: length 14.6
  Top Layer w0.254: 16.55,13.2 16.59,13.16 18.12,13.16 v1(18.31,13.35) ; v1(24.09,12.91) 24.35,13.17 29.14,13.17 30.07,14.1
  Bottom Layer w0.254: v1(18.31,13.35) 18.66,13.69 23.3,13.69 v1(24.09,12.91)
GPIO21: length 15.6
  Top Layer w0.254: 29.82,16.78 27.18,14.14 26.58,14.14 25.57,15.15 19.85,15.15 19.09,14.38 18.52,14.38 17.98,13.85 17.04,13.85 16.75,13.56 16.4,13.56
GPIO22: length 17.5
  Top Layer w0.254: 30.25,22.17 28.65,20.57 26.46,20.56 26.45,20.57 ; 16.4,14.38 18.01,14.38 18.47,14.83 19.01,14.83 19.68,15.51 22.03,15.51 25.13,18.6 25.13,19.27 26.44,20.57
GPIO23: length 21.1
  Top Layer w0.254: 30.33,26.81 30.33,26.19 29.25,25.1 29.25,22.15 28.03,20.93 26.29,20.93 24.57,19.21 24.57,18.76 23.44,17.63 20,17.63 17.17,14.8 16.52,14.8
GPIO24: length 23.3
  Top Layer w0.254: 30.31,29.55 30.31,28.71 28.89,27.29 28.89,22.58 28.84,22.53 28.1,22.53 26.86,21.29 26.14,21.29 24.21,19.36 24.21,18.9 23.29,17.98 19.85,17.98 17.03,15.17 16.45,15.17
RUN: length 34.5
  Top Layer w0.254: 30.45,24.37 30.45,23.72 31.61,22.56 31.61,21.57 30.75,20.71 29.94,20.71 28.09,18.87 28.09,16.74 27.07,15.72 v1(27.07,15.47) ; 14.72,11.17 14.72,11.31 14.75,11.35 ; v1(18.51,8.83) 17.89,9.45 17.89,9.99 17.51,10.37 17.51,11.31 17.02,11.31 16.67,10.96 14.92,10.96 14.76,11.12 ; v1(22.84,8.96) 23.86,9.99 v1(24.86,9.99)
  Bottom Layer w0.254: v1(27.07,15.47) 25.95,14.35 ; v1(18.51,8.83) 18.51,6.35 18.56,6.3 20.17,6.3 v1(22.84,8.96) ; 25.93,14.35 25.93,11.06 v1(24.86,9.99)
SCLK: length 22.1
  Top Layer w0.254: 10.91,30.47 11.09,30.65 v1(11.09,33.84) ; v1(12.25,35.9) 12.25,36.56 10.57,38.24 ; 11.96,18.29 11.96,19.12 12.15,19.31 12.15,28.73 11.81,29.07 11.32,29.07 10.91,29.49 10.91,30.44
  Bottom Layer w0.254: v1(11.09,33.84) 11.09,34.74 v1(12.25,35.9)
SD0: length 21.1
  Top Layer w0.254: v1(11.56,28.49) 11.53,28.45 11.53,18.54 ; v1(13.34,31.15) 13.39,31.2 13.39,36.56 11.78,38.17
  Bottom Layer w0.254: v1(11.56,28.49) 13.34,30.27 v1(13.34,31.15)
SD1: length 14.4
  Top Layer w0.254: 9.22,31.88 9.58,31.52 9.58,19.66 10.23,19 10.56,19 10.76,18.79 10.76,18.27
SD2: length 13.8
  Top Layer w0.254: U3.3 10.49,19.57 11.12,18.94 11.12,18.41 U1.54
SD3: length 21.5
  Top Layer w0.254: 9.22,38.06 12.68,34.6 v1(12.68,31.96) ; 12.32,18.44 12.36,18.49 12.36,18.84 12.61,19.09 12.61,29.81 12.24,30.19
  Bottom Layer w0.254: v1(12.68,31.96) 12.68,30.59 v1(12.27,30.18)
SS: length 53.6
  Top Layer w0.254: v1(20.9,5.62) 20.9,7.84 20.76,7.98 ; v1(20.96,14.57) 20.96,13.87 22.18,12.64 22.18,12.3 22.69,11.79 ; 10.36,18.33 10.36,17.94 10.52,17.78 11.09,17.78 11.27,17.6 v1(11.98,17.6) ; v1(6.47,15.86) 6.51,15.82 7.31,15.82 7.4,15.73 ; U1.56 9.22,19.51 9.22,29.44 7.95,30.71 U3.1 ; 18.55,9.7 19.5,9.7 19.59,9.8 ; v1(8.74,19.16) 9.51,19.16
  Bottom Layer w0.254: v1(6.47,15.86) 6.31,15.86 6.13,16.04 6.13,16.3 8.74,18.9 v1(8.74,19.16) ; v1(20.96,14.57) 20.96,14.99 16.78,19.17 ; v1(22.74,11.83) 22.49,11.57 22.49,10.14 23.53,9.09 23.53,8.25 v1(20.9,5.62) ; v1(11.98,17.6) 11.37,18.21 15.79,18.21 16.73,19.15 ; 20.84,8.07 19.38,9.54 18.58,9.54
  vias: v1(18.49,9.73) v1(20.83,8.1)
SWCLK: length 15
  Top Layer w0.254: v1(17.74,5.4) 17.74,5.41 17.56,5.59 16.74,5.59 14.13,2.91 13.86,2.91 13.79,2.84 ; v1(16.14,10.32) 15.13,10.32 14.85,10.6 14.48,10.6 13.96,11.12 13.96,11.49 13.94,11.52 ; 13.67,2.81 13.67,2.25 13.11,1.69
  Bottom Layer w0.254: v1(16.14,10.32) 17.74,8.72 v1(17.74,5.4)
SWD: length 18.3
  Top Layer w0.254: 14.33,11.59 14.32,11.61 14.32,11.97 14.33,11.96 14.33,12.35 v1(14.48,12.5) ; 18.45,6.56 18.44,6.56 ; 18.45,6.56 18.45,1.8 18.34,1.69 ; 18.45,6.56 18.91,7.03 18.91,7.52 18.97,7.58 20.07,7.58 20.23,7.75 20.23,10.29 20.07,10.46 18.97,10.46 18.91,10.39 18.44,10.39 18.23,10.61 v1(18.1,10.61) ; 18.45,6.56 18.45,6.58
  Bottom Layer w0.254: v1(18.1,10.61) 18.1,11.21 17.53,11.78 15.32,11.78 14.48,12.61 14.48,12.5 v1(14.48,12.5)
USBN: length 36.7
  Top Layer w0.254: v1(25.63,39) 25.59,38.96 v1(25.59,23.64) ; 27.57,18.93 27.93,19.29 v1(27.93,19.84) ; 15.08,46.54 16.36,45.26 v1(18.72,45.26)
  Bottom Layer w0.254: v1(27.93,19.84) 27.93,19.86 25.59,22.2 v1(25.59,23.64) ; v1(18.72,45.26) 19.38,45.26 22.26,42.37 25.34,42.37 25.68,42.03 25.68,41.55 25.63,41.49 v1(25.63,39)
USBP: length 52.7
  Top Layer w0.254: 25.84,18.62 25.65,18.62 23.28,16.24 23.28,15.82 23.55,15.54 v1(26.01,15.54) ; v1(26.31,24.24) 26.45,24.38 v1(26.45,39.08) ; 16.77,46.24 v1(18.43,46.24)
  Bottom Layer w0.254: 28.62,15.79 27.58,15.79 27.31,16.06 26.83,16.06 26.56,15.79 26.25,15.79 v1(26.01,15.54) ; v1(26.31,24.24) 26.31,22.28 28.51,20.08 28.51,19.42 29.76,18.17 30.92,18.17 31.61,17.48 31.61,16.51 30.92,15.82 28.67,15.82 ; v1(26.45,39.08) 25.99,39.54 25.99,41.34 26.04,41.4 26.04,42.18 21.98,46.24 v1(18.43,46.24)
XIN: length 9.3
  Top Layer w0.254: 13.15,8.24 12.83,7.92 11.71,7.92 ; 12.34,11.49 12.32,11.47 12.32,10.71 11.15,9.54 10.39,9.54 10.18,9.33 10.11,9.33 ; 10.14,9.31 9.65,8.82 9.65,8.8 9.48,8.63 9.46,8.63 8.7,7.87 8.68,7.87
  Bottom Layer w0.254: v1(11.71,7.99) 11.44,7.99 10.14,9.29 v1(10.14,9.31)
XOUT: length 5.3
  Top Layer w0.254: v1(12.9,10.45) 12.76,10.59 12.76,11.41 ; v1(11.56,8.94) 10.57,7.95 10.57,7.58
  Bottom Layer w0.254: v1(12.9,10.45) 12.69,10.67 12.69,10.06 v1(11.56,8.94)
$1N3718: length 9.4
  Top Layer w0.254: v1(13.86,4.3) 13.86,5.17 13.87,5.19 14.16,5.19 14.33,5.35 14.33,5.64 14.91,6.22 ; 9.21,4.88 10.37,6.04 10.37,6.12 ; v1(11.92,5.79) 11.58,6.14 10.84,6.14
  Bottom Layer w0.254: v1(11.92,5.79) 11.92,5.08 11.7,4.85 11.7,4.37 12.04,4.03 12.52,4.03 12.8,4.3 v1(13.86,4.3)
$1N3935: length 16.7
  Top Layer w0.254: 25.76,16.13 26.03,16.13 27.04,17.14 ; 25.76,16.13 24.85,16.13 24.82,16.09 24.34,16.09 24.31,16.13 v1(24.05,16.13) ; 20.83,20.04 20.63,19.84 19.19,19.84 19.1,19.75 v1(18.75,19.75) ; 14.84,20.24 14.64,20.04 14.64,19.73 14.34,19.43 14.34,18.57
  Bottom Layer w0.254: v1(14.99,20.45) 17.72,20.45 18.24,19.93 18.48,19.93 18.66,19.75 ; v1(21.04,20.07) 21.04,20 23.98,17.06 23.98,16.11
$1N3938: length 16.4
  Top Layer w0.254: 25.65,17.14 25.17,16.66 24.7,16.66 ; 14.63,21.1 14.63,20.92 14.28,20.57 14.28,19.87 13.96,19.55 13.96,18.58 13.93,18.55 ; v1(18.48,20.51) 20.65,20.51 20.8,20.66 21.28,20.66 21.49,20.45 21.81,20.45
  Bottom Layer w0.254: 24.71,16.84 24.71,17.53 v1(21.76,20.49) ; 18.36,20.42 17.57,21.21 v1(14.63,21.21)
  vias: v1(24.58,16.68)
$1N4390: length 34.7
  Top Layer w0.254: 20.81,11.94 21.22,11.52 21.22,10.83 21.7,10.35 23.3,10.35 ; 7.25,17.42 6.96,17.42 v1(6.41,17.97)
  Bottom Layer w0.254: v1(6.41,17.97) 6.38,18 6.56,18 6.56,17.22 5.77,16.44 5.77,15.73 6.22,15.28 7.93,15.28 11.22,18.57 15.64,18.57 16.58,19.51 16.62,19.51 16.64,19.52 17.82,19.52 23.29,14.05 23.45,14.05 24.01,13.49 24.33,13.49 24.67,13.15 24.67,12.67 24.33,12.33 24.04,12.33 23.32,11.61 23.32,11.58 23.1,11.36 23.1,10.59 v1(23.37,10.32)

## Text on the board
Bottom Silkscreen Layer: Made by: | https://github.com/Osaidii | M. Osaid Hassan | Osaidii
